# EAGLE schematic lab4 (EAGLE 9.3.0)
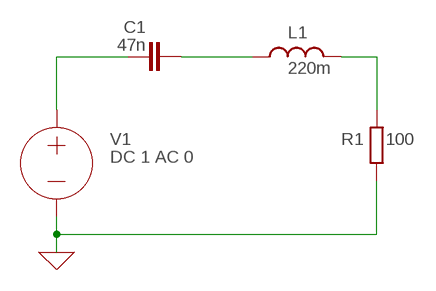
[diagram p0: schematic, sheet 1]

## Parts
C1  47n  C  (no package)
L1  220m  L  (no package)
R1  100  R  (no package)
V1  DC 1 AC 0  VOLTAGE  (no package)

## Nets
0: R1.1 V1.- ; supply symbol labelled GND
N$1: C1.1 V1.+
N$2: C1.2 L1.1
N$3: L1.2 R1.2

## Library data of the parts
C1 = ngspice-simulation:C: CAPACITOR; SPICEPREFIX: C
L1 = ngspice-simulation:L: INDUCTOR
R1 = ngspice-simulation:R: RESISTOR
V1 = ngspice-simulation:VOLTAGE: Independent Voltage Source, either DC, AC, PULSE, SINE, PWL, EXP, or SFFM; VALUE: 0V